# Altium project DanielFairbanksPCB_18_3_6.PrjPcb
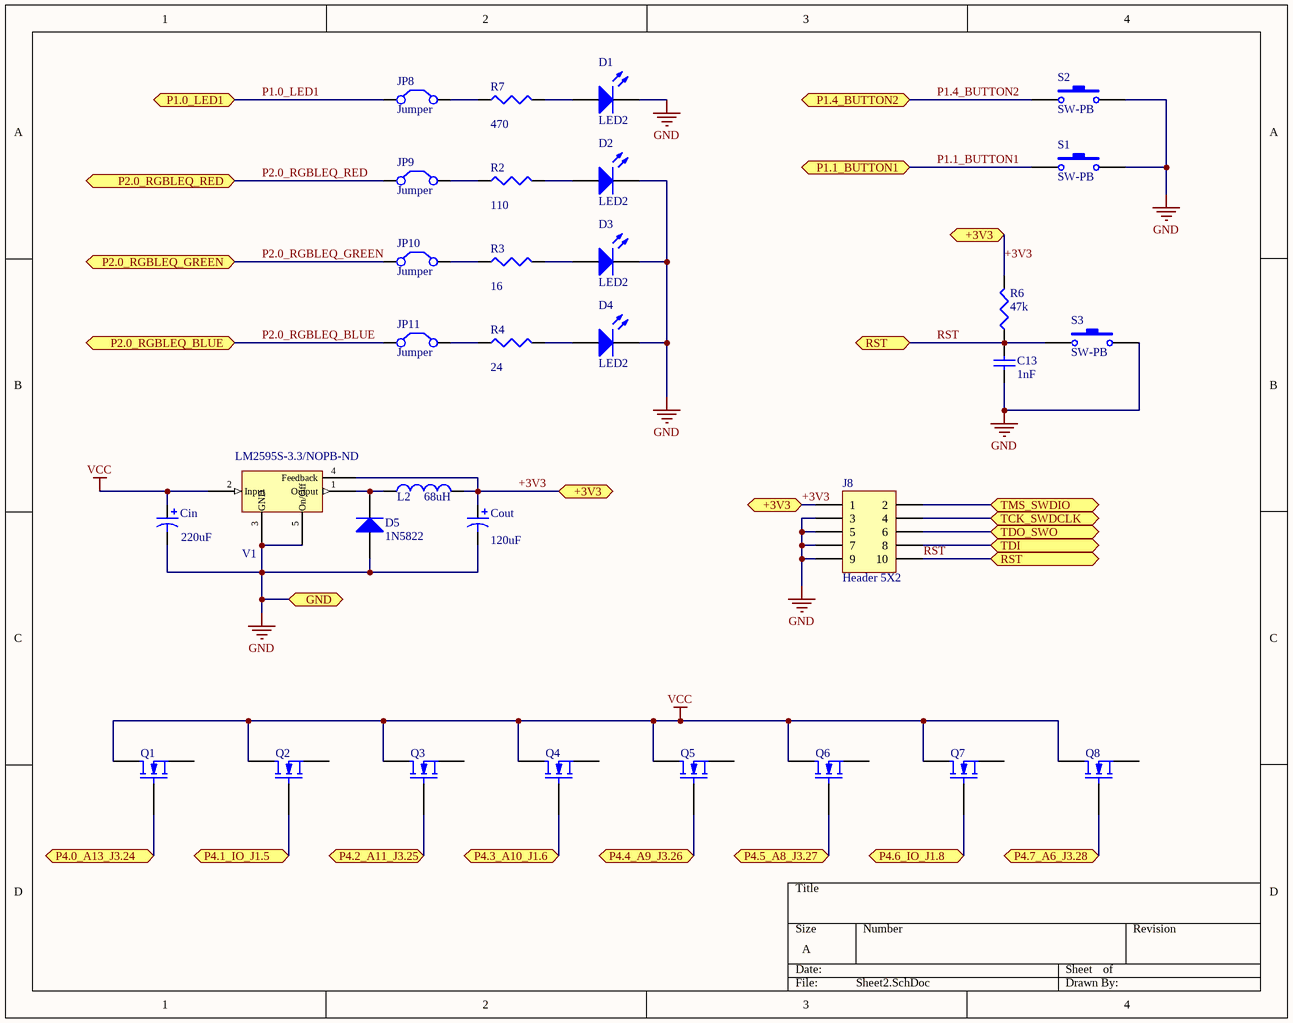
[diagram p0: Sheet2.SchDoc]
1 sheet, 31 parts. Net scope: flat (ports and power ports of the same name join across sheets).
Board file: PCB1.PcbDoc

## Sheet Sheet2.SchDoc
size A

### Parts
C13  value 1nF  [0402]  (hidden comment: Cap Semi)
Cin  value 220uF  [C0805]  (hidden comment: Cap Pol3)
Cout  value 120uF  [C0805]  (hidden comment: Cap Pol3)
D1  LED2  [3.2X1.6X1.1]
D2  LED2  [3.2X1.6X1.1]
D3  LED2  [3.2X1.6X1.1]
D4  LED2  [3.2X1.6X1.1]
D5  1N5822  [DO-201AD]
J8  Header 5X2  [HDR2X5]
JP8  Jumper  [RAD-0.2]
JP9  Jumper  [RAD-0.2]
JP10  Jumper  [RAD-0.2]
JP11  Jumper  [RAD-0.2]
L2  value 68uH  [0402-A]  (hidden comment: Inductor)
Q1  MOSFET-N  [SiUD41ED]  (value not drawn)
Q2  MOSFET-N  [SiUD41ED]  (value not drawn)
Q3  MOSFET-N  [SiUD41ED]  (value not drawn)
Q4  MOSFET-N  [SiUD41ED]  (value not drawn)
Q5  MOSFET-N  [SiUD41ED]  (value not drawn)
Q6  MOSFET-N  [SiUD41ED]  (value not drawn)
Q7  MOSFET-N  [SiUD41ED]  (value not drawn)
Q8  MOSFET-N  [SiUD41ED]  (value not drawn)
R2  value 110  [J1-0603]  (hidden comment: Res3)
R3  value 16  [J1-0603]  (hidden comment: Res3)
R4  value 24  [J1-0603]  (hidden comment: Res3)
R6  value 47k  [J1-0603]  (hidden comment: Res3)
R7  value 470  [J1-0603]  (hidden comment: Res3)
S1  SW-PB  [SPST-2]
S2  SW-PB  [SPST-2]
S3  SW-PB  [SPST-2]
V1  LM2595S-3.3/NOPB-ND  [LM2595S-3.3/NOPB-ND]

### Ports
+3V3, GND, P1.0_LED1, P1.1_BUTTON1, P1.4_BUTTON2, P2.0_RGBLEQ_BLUE, P2.0_RGBLEQ_GREEN, P2.0_RGBLEQ_RED, P4.0_A13_J3.24, P4.1_IO_J1.5, P4.2_A11_J3.25, P4.3_A10_J1.6, P4.4_A9_J3.26, P4.5_A8_J3.27, P4.6_IO_J1.8, P4.7_A6_J3.28, RST, TCK_SWDCLK, TDI, TDO_SWO, TMS_SWDIO

### Nets
GND: C13.1 Cin.2 Cout.2 D1.2(K) D2.2(K) D3.2(K) D4.2(K) D5.1(A) J8.3 J8.5 J8.7 J8.9 S1.2 S2.2 S3.2 V1.3(GND) V1.5(On/Off) ; port GND
VCC: Cin.1 Q1.3 Q2.3 Q3.3 Q4.3 Q5.3 Q6.3 Q7.3 Q8.3 V1.2(Input)
+3V3: Cout.1 J8.1 L2.2 R6.2 V1.4(Feedback) ; port +3V3
P1.0_LED1: JP8.1(C1) ; port P1.0_LED1
P1.1_BUTTON1: S1.1 ; port P1.1_BUTTON1
P1.4_BUTTON2: S2.1 ; port P1.4_BUTTON2
P2.0_RGBLEQ_BLUE: JP11.1(C1) ; port P2.0_RGBLEQ_BLUE
P2.0_RGBLEQ_GREEN: JP10.1(C1) ; port P2.0_RGBLEQ_GREEN
P2.0_RGBLEQ_RED: JP9.1(C1) ; port P2.0_RGBLEQ_RED
RST: C13.2 J8.10 R6.1 S3.1 ; port RST
NetD1_1: D1.1(A) R7.2
NetD2_1: D2.1(A) R2.2
NetD3_1: D3.1(A) R3.2
NetD4_1: D4.1(A) R4.2
NetD5_2: D5.2(K) L2.1 V1.1(Output)
NetJ8_2: J8.2 ; port TMS_SWDIO
NetJ8_4: J8.4 ; port TCK_SWDCLK
NetJ8_6: J8.6 ; port TDO_SWO
NetJ8_8: J8.8 ; port TDI
NetJP8_2: JP8.2(C2) R7.1
NetJP9_2: JP9.2(C2) R2.1
NetJP10_2: JP10.2(C2) R3.1
NetJP11_2: JP11.2(C2) R4.1
NetQ1_1: Q1.1 ; port P4.0_A13_J3.24
NetQ2_1: Q2.1 ; port P4.1_IO_J1.5
NetQ3_1: Q3.1 ; port P4.2_A11_J3.25
NetQ4_1: Q4.1 ; port P4.3_A10_J1.6
NetQ5_1: Q5.1 ; port P4.4_A9_J3.26
NetQ6_1: Q6.1 ; port P4.5_A8_J3.27
NetQ7_1: Q7.1 ; port P4.6_IO_J1.8
NetQ8_1: Q8.1 ; port P4.7_A6_J3.28

Not connected (* = marked no-connect by the designer): Q1 2; Q2 2; Q3 2; Q4 2; Q5 2; Q6 2; Q7 2; Q8 2

### Library data of the parts
C13 = Cap Semi: Capacitor (Semiconductor SIM Model); Published: 8-Jun-2000; LatestRevisionDate: 29-May-2009; LatestRevisionNote: IPC-7351 Footprint Added.; PackageReference: C1206; Publisher: Altium Limited; PackageDescription: Chip Capacitor
Cin Cout = Cap Pol3: Polarized Capacitor (Surface Mount); Published: 8-Jun-2000; LatestRevisionDate: 29-May-2009; LatestRevisionNote: IPC-7351 Footprint Added.; PackageReference: C0805; Publisher: Altium Limited; PackageDescription: Chip Capacitor
D1-D4 = LED2: Typical RED, GREEN, YELLOW, AMBER GaAs LED; Published: 8-Jun-2000; LatestRevisionDate: 17-Jul-2002; LatestRevisionNote: Re-released for DXP Platform.; PackageVersion: Feb-2002; PackageReference: 3.2X1.6X1.1; Publisher: Altium Limited; PackageDescription: SM LED; 2 Flat Leads
D5 = Diode 1N5408: 3 Amp Medium Power Silicon Rectifier Diode; Published: 8-Jun-2000; LatestRevisionDate: 17-Jul-2002; LatestRevisionNote: Re-released for DXP Platform.; DatasheetVersion: Aug-1984; PackageReference: DO-201AD; Publisher: Altium Limited; PackageDescription: Diode, Axial; Body 9.5 x 5.3 mm (LxDia. max), Lead Dia. 1.32 mm (max); ComponentLink1Description: Manufacturer Link; ComponentLink1URL: http://www.irf.com/
J8 = Header 5X2: Header, 5-Pin, Dual row; LatestRevisionDate: 17-Jul-2002; LatestRevisionNote: Re-released for DXP Platform.; Publisher: Altium Limited
JP8-JP11 = Jumper: Jumper Wire; Published: 24-Mar-1999; LatestRevisionDate: 17-Jul-2002; LatestRevisionNote: Re-released for DXP Platform.; PackageReference: RAD-0.2; Publisher: Altium Limited; PackageDescription: Radial Cap, Thru-Hole; 2 Leads; 0.2 in Pin Spacing
L2 = Inductor: Code_IEC: 1005; Published: 8-Jun-2000; LatestRevisionDate: 29-May-2009; LatestRevisionNote: IPC-7351 Footprint Added.; PackageReference: 0402-A; Publisher: Altium Limited; PackageDescription: Chip Inductor; Code_JEITA: 0402
Q1-Q8 = SiUD41ED
R2-R4 R6 R7 = Res3: Resistor; Published: 8-Jun-2000; LatestRevisionDate: 29-May-2009; LatestRevisionNote: IPC-7351 Footprint Added.; PackageReference: J1-0603; Publisher: Altium Limited; PackageDescription: Chip Resistor
S1-S3 = SW-PB: Switch; Published: 24-Mar-1999; LatestRevisionDate: 17-Jul-2002; LatestRevisionNote: Re-released for DXP Platform.; PackageReference: SPST-2; Publisher: Altium Limited; PackageDescription: Switch; 2 Leads